# Altium schematic sheet Urukul.schdoc: 3U DDS (URUKUL) v1.1
size 420 x 297 mm; Author: G.K.; CompanyName: WUT; DrawnBy: G.K.; Organization: WUT ISE; Address1: Warsaw Univeristy of Technology; Address2: Nowowiejska 15/19; DocumentNumber: 1; Revision: -; SheetNumber: 1; SheetTotal: 7; EDA_Number: ARTIQ; Projet: ARTIQ/SINARA; ModifiedBy: -; CreateDate: XX/XX/XXXX; CheckedDate: -; Title2: Top entity; DivGrp: ISE; Designer: G.K.; ModifiedDate: -; ProjectName: ARTIQ/SINARA
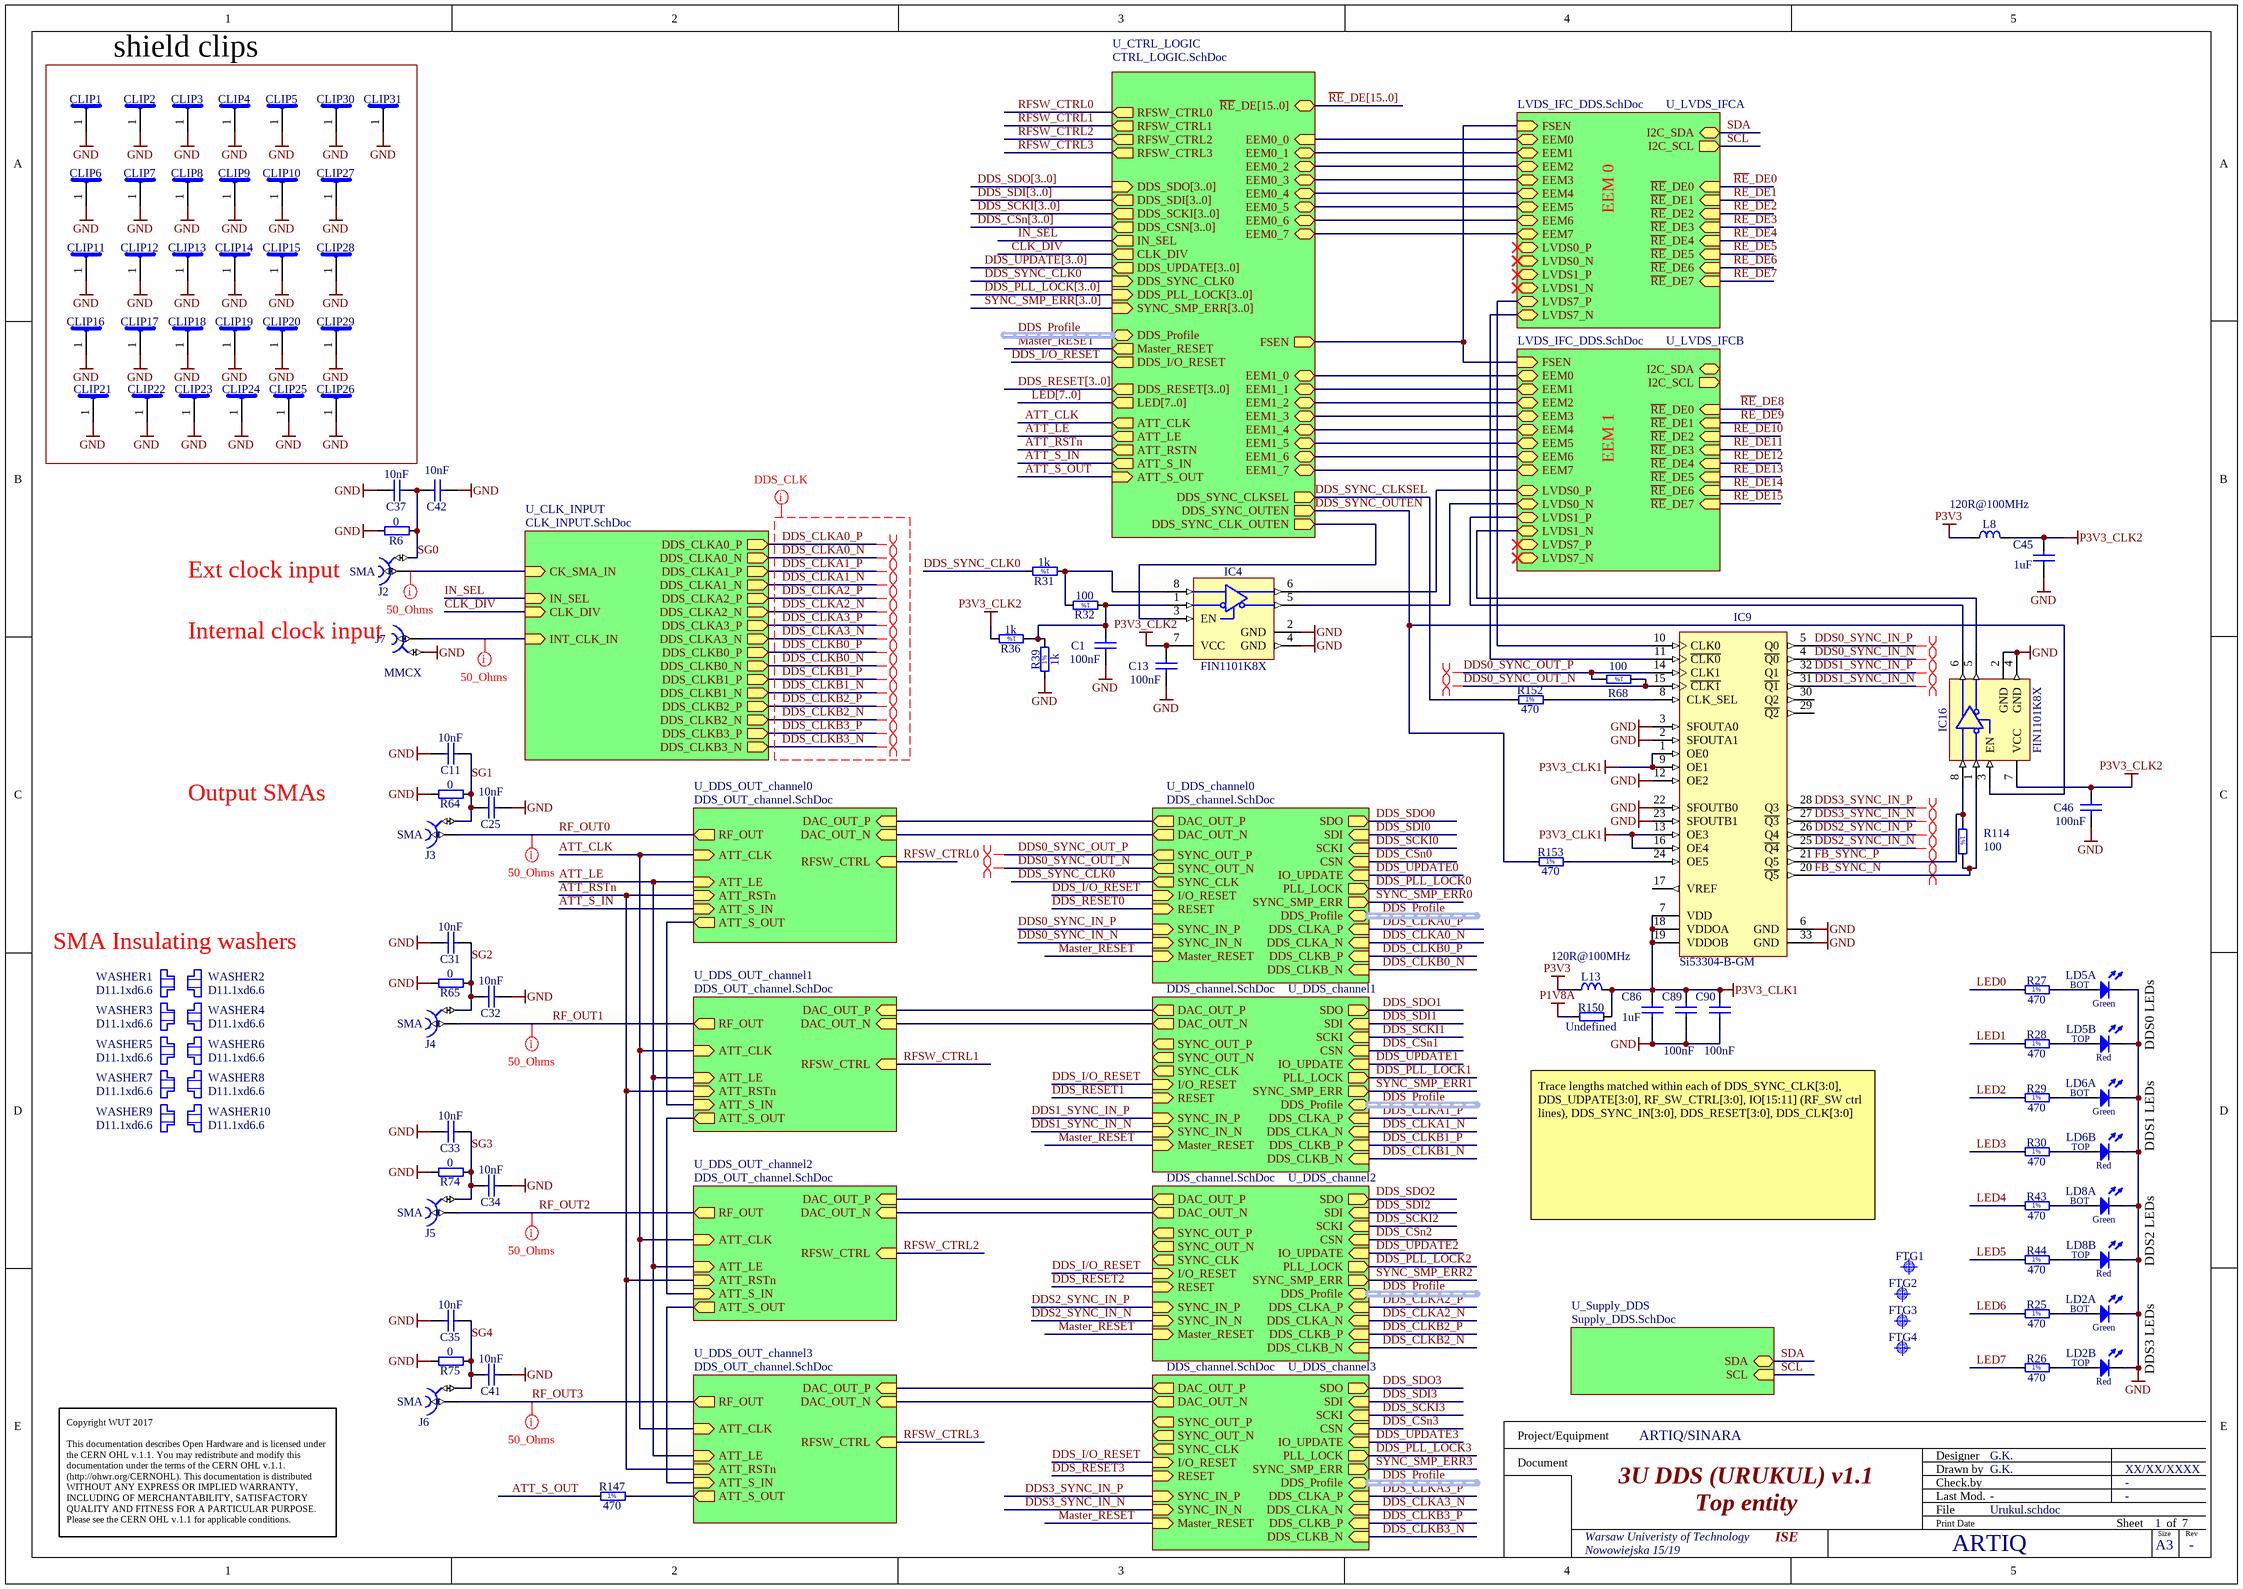
[diagram p0: Urukul.schdoc]

## Parts
C1  100nF  [CAPC1005X55N]
C11  10nF  [CAPC1005X55N]
C13  100nF  [CAPC1005X55N]
C25  10nF  [CAPC1005X55N]
C31  10nF  [CAPC1005X55N]
C32  10nF  [CAPC1005X55N]
C33  10nF  [CAPC1005X55N]
C34  10nF  [CAPC1005X55N]
C35  10nF  [CAPC1005X55N]
C37  10nF  [CAPC1005X55N]
C41  10nF  [CAPC1005X55N]
C42  10nF  [CAPC1005X55N]
C45  1uF  [CAPC1005X55N]
C46  100nF  [CAPC1005X55N]
C86  1uF  [CAPC1005X55N]
C89  100nF  [CAPC1005X55N]
C90  100nF  [CAPC1005X55N]
CLIP1  S1411-46R  [CLIP_HOLLAND-SHIELDING_LC]  (value not drawn)
CLIP2  S1411-46R  [CLIP_HOLLAND-SHIELDING_LC]  (value not drawn)
CLIP3  S1411-46R  [CLIP_HOLLAND-SHIELDING_LC]  (value not drawn)
CLIP4  S1411-46R  [CLIP_HOLLAND-SHIELDING_LC]  (value not drawn)
CLIP5  S1411-46R  [CLIP_HOLLAND-SHIELDING_LC]  (value not drawn)
CLIP6  S1411-46R  [CLIP_HOLLAND-SHIELDING_LC]  (value not drawn)
CLIP7  S1411-46R  [CLIP_HOLLAND-SHIELDING_LC]  (value not drawn)
CLIP8  S1411-46R  [CLIP_HOLLAND-SHIELDING_LC]  (value not drawn)
CLIP9  S1411-46R  [CLIP_HOLLAND-SHIELDING_LC]  (value not drawn)
CLIP10  S1411-46R  [CLIP_HOLLAND-SHIELDING_LC]  (value not drawn)
CLIP11  S1411-46R  [CLIP_HOLLAND-SHIELDING_LC]  (value not drawn)
CLIP12  S1411-46R  [CLIP_HOLLAND-SHIELDING_LC]  (value not drawn)
CLIP13  S1411-46R  [CLIP_HOLLAND-SHIELDING_LC]  (value not drawn)
CLIP14  S1411-46R  [CLIP_HOLLAND-SHIELDING_LC]  (value not drawn)
CLIP15  S1411-46R  [CLIP_HOLLAND-SHIELDING_LC]  (value not drawn)
CLIP16  S1411-46R  [CLIP_HOLLAND-SHIELDING_LC]  (value not drawn)
CLIP17  S1411-46R  [CLIP_HOLLAND-SHIELDING_LC]  (value not drawn)
CLIP18  S1411-46R  [CLIP_HOLLAND-SHIELDING_LC]  (value not drawn)
CLIP19  S1411-46R  [CLIP_HOLLAND-SHIELDING_LC]  (value not drawn)
CLIP20  S1411-46R  [CLIP_HOLLAND-SHIELDING_LC]  (value not drawn)
CLIP21  S1411-46R  [CLIP_HOLLAND-SHIELDING_LC]  (value not drawn)
CLIP22  S1411-46R  [CLIP_HOLLAND-SHIELDING_LC]  (value not drawn)
CLIP23  S1411-46R  [CLIP_HOLLAND-SHIELDING_LC]  (value not drawn)
CLIP24  S1411-46R  [CLIP_HOLLAND-SHIELDING_LC]  (value not drawn)
CLIP25  S1411-46R  [CLIP_HOLLAND-SHIELDING_LC]  (value not drawn)
CLIP26  S1411-46R  [CLIP_HOLLAND-SHIELDING_LC]  (value not drawn)
CLIP27  S1411-46R  [CLIP_HOLLAND-SHIELDING_LC]  (value not drawn)
CLIP28  S1411-46R  [CLIP_HOLLAND-SHIELDING_LC]  (value not drawn)
CLIP29  S1411-46R  [CLIP_HOLLAND-SHIELDING_LC]  (value not drawn)
CLIP30  S1411-46R  [CLIP_HOLLAND-SHIELDING_LC]  (value not drawn)
CLIP31  S1411-46R  [CLIP_HOLLAND-SHIELDING_LC]  (value not drawn)
FTG1  Use only in PCB  [FIDUCIAL_TOP_C100-200]  (value not drawn)
FTG2  Use only in PCB  [FIDUCIAL_TOP_S100-200]  (value not drawn)
FTG3  Use only in PCB  [FIDUCIAL_TOP_S200-400]  (value not drawn)
FTG4  Use only in PCB  [FIDUCIAL_TOP_S100-200]  (value not drawn)
IC4  FIN1101K8X  [SOP50P310X90-8N]
IC9  Si53304-B-GM  [SLAB-QFN-32-2150x2150TP_M]
IC16  FIN1101K8X  [SOP50P310X90-8N]
J2  SMA  [RF249BT0050GHDW]
J3  SMA  [RF249BT0050GHDW]
J4  SMA  [RF249BT0050GHDW]
J5  SMA  [RF249BT0050GHDW]
J6  SMA  [RF249BT0050GHDW]
J7  MMCX  [SAMTEC_MMCX-J-P-H-ST-TH1]
L8  120R@100MHz  [INDC1608X95N]
L13  120R@100MHz  [INDC1608X95N]
LD2  Red/Green  [LED_DIALIGHT_553-0112-200F]  (value not drawn)  (parts A,B of 2)
LD5  Red/Green  [LED_DIALIGHT_553-0112-200F]  (value not drawn)  (parts A,B of 2)
LD6  Red/Green  [LED_DIALIGHT_553-0112-200F]  (value not drawn)  (parts A,B of 2)
LD8  Red/Green  [LED_DIALIGHT_553-0112-200F]  (value not drawn)  (parts A,B of 2)
R6  0  [RESC1005X40N]
R25  470  [RESC1005X40N]
R26  470  [RESC1005X40N]
R27  470  [RESC1005X40N]
R28  470  [RESC1005X40N]
R29  470  [RESC1005X40N]
R30  470  [RESC1005X40N]
R31  1k  [RESC1005X40N]
R32  100  [RESC1005X40N]
R36  1k  [RESC1005X40N]
R39  1k  [RESC1005X40N]
R43  470  [RESC1005X40N]
R44  470  [RESC1005X40N]
R64  0  [RESC1005X40N]
R65  0  [RESC1005X40N]
R68  100  [RESC1005X40N]
R74  0  [RESC1005X40N]
R75  0  [RESC1005X40N]
R114  100  [RESC1005X40N]
R147  470  [RESC1005X40N]
R150  Undefined  [RESC1608X55N]
R152  470  [RESC1005X40N]
R153  470  [RESC1005X40N]
WASHER1  D11.1xd6.6  [Keystone_7687]
WASHER2  D11.1xd6.6  [Keystone_7687]
WASHER3  D11.1xd6.6  [Keystone_7687]
WASHER4  D11.1xd6.6  [Keystone_7687]
WASHER5  D11.1xd6.6  [Keystone_7687]
WASHER6  D11.1xd6.6  [Keystone_7687]
WASHER7  D11.1xd6.6  [Keystone_7687]
WASHER8  D11.1xd6.6  [Keystone_7687]
WASHER9  D11.1xd6.6  [Keystone_7687]
WASHER10  D11.1xd6.6  [Keystone_7687]

## Blocks framed on the sheet
shield clips: CLIP1-CLIP31

## Sub-sheets
U_CLK_INPUT = CLK_INPUT.SchDoc: CK_SMA_IN (in), INT_CLK_IN (in), IN_SEL (in), DDS_CLKA0_P (out), DDS_CLKA0_N (out), CLK_DIV (in), DDS_CLKB3_P (out), DDS_CLKB3_N (out), DDS_CLKA1_P (out), DDS_CLKA1_N (out), DDS_CLKA2_P (out), DDS_CLKA2_N (out), DDS_CLKA3_P (out), DDS_CLKA3_N (out), DDS_CLKB0_P (out), DDS_CLKB0_N (out), DDS_CLKB1_P (out), DDS_CLKB1_N (out), DDS_CLKB2_P (out), DDS_CLKB2_N (out)
U_CTRL_LOGIC = CTRL_LOGIC.SchDoc: RFSW_CTRL1 (out), RFSW_CTRL2 (out), RFSW_CTRL3 (out), RFSW_CTRL0 (out), EEM0_0 (in), EEM0_1 (bidir), IN_SEL (out), EEM0_2 (bidir), ~{RE}_DE[15..0] (bidir), DDS_UPDATE[3..0] (out), DDS_CSN[3..0] (out), DDS_SCKI[3..0] (out), DDS_SDI[3..0] (out), DDS_SDO[3..0] (in), EEM0_3 (bidir), EEM0_4 (bidir), EEM0_5 (bidir), EEM0_6 (bidir), EEM0_7 (bidir), EEM1_0 (bidir), EEM1_1 (bidir), EEM1_2 (bidir), EEM1_3 (bidir), EEM1_4 (bidir), EEM1_5 (bidir), EEM1_6 (bidir), EEM1_7 (bidir), DDS_Profile (harness DDS_Profile), ATT_CLK (out), ATT_LE (out), ATT_RSTN (out), ATT_S_IN (out), ATT_S_OUT (in), LED[7..0] (out), DDS_SYNC_CLKSEL (out), DDS_SYNC_OUTEN (out), DDS_SYNC_CLK_OUTEN (out), DDS_SYNC_CLK0 (in), DDS_I/O_RESET (out), DDS_PLL_LOCK[3..0] (in), SYNC_SMP_ERR[3..0] (in), CLK_DIV (out), Master_RESET (out), DDS_RESET[3..0] (out), FSEN (out)
U_DDS_channel0 = DDS_channel.SchDoc: CSN (in), SDI (in), SCKI (in), SDO (out), DAC_OUT_P (out), DAC_OUT_N (out), RESET (in), IO_UPDATE (in), DDS_Profile (harness DDS_Profile), SYNC_CLK (out), SYNC_OUT_P (out), SYNC_OUT_N (out), SYNC_IN_P (in), SYNC_IN_N (in), I/O_RESET (in), SYNC_SMP_ERR (out), PLL_LOCK (out), DDS_CLKB_P (in), DDS_CLKB_N (in), DDS_CLKA_P (in), DDS_CLKA_N (in), Master_RESET (in)
U_DDS_channel1 = DDS_channel.SchDoc: CSN (in), SDI (in), SCKI (in), SDO (out), DAC_OUT_P (out), DAC_OUT_N (out), IO_UPDATE (in), DDS_Profile (harness DDS_Profile), SYNC_CLK (out), SYNC_OUT_P (out), SYNC_OUT_N (out), SYNC_IN_P (in), SYNC_IN_N (in), RESET (in), I/O_RESET (in), SYNC_SMP_ERR (out), PLL_LOCK (out), DDS_CLKB_P (in), DDS_CLKB_N (in), DDS_CLKA_P (in), DDS_CLKA_N (in), Master_RESET (in)
U_DDS_channel2 = DDS_channel.SchDoc: CSN (in), SDI (in), SCKI (in), SDO (out), DAC_OUT_P (out), DAC_OUT_N (out), IO_UPDATE (in), DDS_Profile (harness DDS_Profile), SYNC_CLK (out), SYNC_OUT_P (out), SYNC_OUT_N (out), SYNC_IN_P (in), SYNC_IN_N (in), RESET (in), I/O_RESET (in), SYNC_SMP_ERR (out), PLL_LOCK (out), DDS_CLKB_P (in), DDS_CLKB_N (in), DDS_CLKA_P (in), DDS_CLKA_N (in), Master_RESET (in)
U_DDS_channel3 = DDS_channel.SchDoc: CSN (in), SDI (in), SCKI (in), SDO (out), DAC_OUT_P (out), DAC_OUT_N (out), IO_UPDATE (in), DDS_Profile (harness DDS_Profile), SYNC_CLK (out), SYNC_OUT_P (out), SYNC_OUT_N (out), SYNC_IN_P (in), SYNC_IN_N (in), RESET (in), I/O_RESET (in), SYNC_SMP_ERR (out), PLL_LOCK (out), DDS_CLKB_P (in), DDS_CLKB_N (in), DDS_CLKA_P (in), DDS_CLKA_N (in), Master_RESET (in)
U_DDS_OUT_channel0 = DDS_OUT_channel.SchDoc: DAC_OUT_P (in), DAC_OUT_N (in), RF_OUT (out), RFSW_CTRL (in), ATT_CLK (in), ATT_S_IN (in), ATT_LE (in), ATT_RSTn (in), ATT_S_OUT (out)
U_DDS_OUT_channel1 = DDS_OUT_channel.SchDoc: DAC_OUT_P (in), DAC_OUT_N (in), RF_OUT (out), RFSW_CTRL (in), ATT_CLK (in), ATT_S_IN (in), ATT_LE (in), ATT_RSTn (in), ATT_S_OUT (out)
U_DDS_OUT_channel2 = DDS_OUT_channel.SchDoc: DAC_OUT_P (in), DAC_OUT_N (in), RF_OUT (out), RFSW_CTRL (in), ATT_CLK (in), ATT_S_IN (in), ATT_LE (in), ATT_RSTn (in), ATT_S_OUT (out)
U_DDS_OUT_channel3 = DDS_OUT_channel.SchDoc: DAC_OUT_P (in), DAC_OUT_N (in), RF_OUT (out), RFSW_CTRL (in), ATT_CLK (in), ATT_S_IN (in), ATT_LE (in), ATT_RSTn (in), ATT_S_OUT (out)
U_LVDS_IFCA = LVDS_IFC_DDS.SchDoc: ~{RE}_DE1 (in), ~{RE}_DE2 (in), ~{RE}_DE3 (in), ~{RE}_DE4 (in), ~{RE}_DE5 (in), ~{RE}_DE6 (in), ~{RE}_DE7 (in), ~{RE}_DE0 (in), I2C_SDA (bidir), I2C_SCL (out), EEM1 (bidir), EEM2 (bidir), EEM5 (bidir), EEM6 (bidir), EEM7 (bidir), EEM3 (bidir), EEM4 (bidir), EEM0 (bidir), LVDS1_P (bidir), LVDS1_N (bidir), LVDS0_P (bidir), LVDS0_N (bidir), LVDS7_P (bidir), LVDS7_N (bidir), FSEN (in)
U_LVDS_IFCB = LVDS_IFC_DDS.SchDoc: I2C_SDA (bidir), I2C_SCL (out), EEM1 (bidir), EEM2 (bidir), EEM5 (bidir), EEM6 (bidir), EEM7 (bidir), EEM3 (bidir), EEM4 (bidir), EEM0 (bidir), ~{RE}_DE1 (in), ~{RE}_DE2 (in), ~{RE}_DE3 (in), ~{RE}_DE4 (in), ~{RE}_DE5 (in), ~{RE}_DE6 (in), ~{RE}_DE7 (in), ~{RE}_DE0 (in), LVDS1_P (bidir), LVDS1_N (bidir), LVDS0_P (bidir), LVDS0_N (bidir), LVDS7_P (bidir), LVDS7_N (bidir), FSEN (in)
U_Supply_DDS = Supply_DDS.SchDoc: SDA (bidir), SCL (in)

## Nets
GND: C1.1 C11.2 C13.1 C25.1 C31.2 C32.1 C33.2 C34.1 C35.2 C37.2 C41.1 C42.1 C45.1 C46.1 C86.1 C89.1 C90.1 CLIP1.1 CLIP2.1 CLIP3.1 CLIP4.1 CLIP5.1 CLIP6.1 CLIP7.1 CLIP8.1 CLIP9.1 CLIP10.1 CLIP11.1 CLIP12.1 CLIP13.1 CLIP14.1 CLIP15.1 CLIP16.1 CLIP17.1 CLIP18.1 CLIP19.1 CLIP20.1 CLIP21.1 CLIP22.1 CLIP23.1 CLIP24.1 CLIP25.1 CLIP26.1 CLIP27.1 CLIP28.1 CLIP29.1 CLIP30.1 CLIP31.1 IC4.2(GND) IC4.4(GND) IC9.2(SFOUTA1) IC9.3(SFOUTA0) IC9.6(GND) IC9.12(OE2) IC9.22(SFOUTB0) IC9.23(SFOUTB1) IC9.33(GND) IC16.2(GND) IC16.4(GND) J7.2 LD2.1(C) LD2.3(C) LD5.1(C) LD5.3(C) LD6.1(C) LD6.3(C) LD8.1(C) LD8.3(C) R6.1 R39.1 R64.1 R65.1 R74.1 R75.1
P1V8A: R150.1
P3V3: L8.2 L13.2
P3V3_CLK1: C86.2 C89.2 C90.2 IC9.1(OE0) IC9.7(VDD) IC9.9(OE1) IC9.13(OE3) IC9.16(OE4) IC9.18(VDDOA) IC9.19(VDDOB) L13.1 R150.2
P3V3_CLK2: C13.2 C45.2 C46.2 IC4.7(VCC) IC16.7(VCC) L8.1 R36.2
ATT_CLK: sheet U_DDS_OUT_channel0/ATT_CLK, sheet U_DDS_OUT_channel1/ATT_CLK, sheet U_DDS_OUT_channel2/ATT_CLK, sheet U_DDS_OUT_channel3/ATT_CLK, sheet U_CTRL_LOGIC/ATT_CLK
ATT_LE: sheet U_DDS_OUT_channel0/ATT_LE, sheet U_DDS_OUT_channel1/ATT_LE, sheet U_DDS_OUT_channel2/ATT_LE, sheet U_DDS_OUT_channel3/ATT_LE, sheet U_CTRL_LOGIC/ATT_LE
ATT_RSTn: sheet U_DDS_OUT_channel0/ATT_RSTn, sheet U_DDS_OUT_channel1/ATT_RSTn, sheet U_DDS_OUT_channel2/ATT_RSTn, sheet U_DDS_OUT_channel3/ATT_RSTn, sheet U_CTRL_LOGIC/ATT_RSTN
ATT_S_IN: sheet U_DDS_OUT_channel0/ATT_S_IN, sheet U_CTRL_LOGIC/ATT_S_IN
ATT_S_OUT: R147.1 ; sheet U_CTRL_LOGIC/ATT_S_OUT
CLK_DIV: sheet U_CTRL_LOGIC/CLK_DIV, sheet U_CLK_INPUT/CLK_DIV
DDS0_SYNC_IN_N: IC9.4(~{Q0}) ; sheet U_DDS_channel0/SYNC_IN_N
DDS0_SYNC_IN_P: IC9.5(Q0) ; sheet U_DDS_channel0/SYNC_IN_P
DDS0_SYNC_OUT_N: IC9.15(~{CLK1}) R68.1 ; sheet U_DDS_channel0/SYNC_OUT_N
DDS0_SYNC_OUT_P: IC9.14(CLK1) R68.2 ; sheet U_DDS_channel0/SYNC_OUT_P
DDS1_SYNC_IN_N: IC9.31(~{Q1}) ; sheet U_DDS_channel1/SYNC_IN_N
DDS1_SYNC_IN_P: IC9.32(Q1) ; sheet U_DDS_channel1/SYNC_IN_P
DDS2_SYNC_IN_N: IC9.25(~{Q4}) ; sheet U_DDS_channel2/SYNC_IN_N
DDS2_SYNC_IN_P: IC9.26(Q4) ; sheet U_DDS_channel2/SYNC_IN_P
DDS3_SYNC_IN_N: IC9.27(~{Q3}) ; sheet U_DDS_channel3/SYNC_IN_N
DDS3_SYNC_IN_P: IC9.28(Q3) ; sheet U_DDS_channel3/SYNC_IN_P
DDS_CLKA0_N: sheet U_DDS_channel0/DDS_CLKA_N, sheet U_CLK_INPUT/DDS_CLKA0_N
DDS_CLKA0_P: sheet U_DDS_channel0/DDS_CLKA_P, sheet U_CLK_INPUT/DDS_CLKA0_P
DDS_CLKA1_N: sheet U_DDS_channel1/DDS_CLKA_N, sheet U_CLK_INPUT/DDS_CLKA1_N
DDS_CLKA1_P: sheet U_DDS_channel1/DDS_CLKA_P, sheet U_CLK_INPUT/DDS_CLKA1_P
DDS_CLKA2_N: sheet U_DDS_channel2/DDS_CLKA_N, sheet U_CLK_INPUT/DDS_CLKA2_N
DDS_CLKA2_P: sheet U_DDS_channel2/DDS_CLKA_P, sheet U_CLK_INPUT/DDS_CLKA2_P
DDS_CLKA3_N: sheet U_DDS_channel3/DDS_CLKA_N, sheet U_CLK_INPUT/DDS_CLKA3_N
DDS_CLKA3_P: sheet U_DDS_channel3/DDS_CLKA_P, sheet U_CLK_INPUT/DDS_CLKA3_P
DDS_CLKB0_N: sheet U_DDS_channel0/DDS_CLKB_N, sheet U_CLK_INPUT/DDS_CLKB0_N
DDS_CLKB0_P: sheet U_DDS_channel0/DDS_CLKB_P, sheet U_CLK_INPUT/DDS_CLKB0_P
DDS_CLKB1_N: sheet U_DDS_channel1/DDS_CLKB_N, sheet U_CLK_INPUT/DDS_CLKB1_N
DDS_CLKB1_P: sheet U_DDS_channel1/DDS_CLKB_P, sheet U_CLK_INPUT/DDS_CLKB1_P
DDS_CLKB2_N: sheet U_DDS_channel2/DDS_CLKB_N, sheet U_CLK_INPUT/DDS_CLKB2_N
DDS_CLKB2_P: sheet U_DDS_channel2/DDS_CLKB_P, sheet U_CLK_INPUT/DDS_CLKB2_P
DDS_CLKB3_N: sheet U_DDS_channel3/DDS_CLKB_N, sheet U_CLK_INPUT/DDS_CLKB3_N
DDS_CLKB3_P: sheet U_DDS_channel3/DDS_CLKB_P, sheet U_CLK_INPUT/DDS_CLKB3_P
DDS_CSn0: sheet U_DDS_channel0/CSN
DDS_CSn1: sheet U_DDS_channel1/CSN
DDS_CSn2: sheet U_DDS_channel2/CSN
DDS_CSn3: sheet U_DDS_channel3/CSN
DDS_I/O_RESET: sheet U_DDS_channel0/I/O_RESET, sheet U_DDS_channel1/I/O_RESET, sheet U_DDS_channel2/I/O_RESET, sheet U_DDS_channel3/I/O_RESET, sheet U_CTRL_LOGIC/DDS_I/O_RESET
DDS_PLL_LOCK0: sheet U_DDS_channel0/PLL_LOCK
DDS_PLL_LOCK1: sheet U_DDS_channel1/PLL_LOCK
DDS_PLL_LOCK2: sheet U_DDS_channel2/PLL_LOCK
DDS_PLL_LOCK3: sheet U_DDS_channel3/PLL_LOCK
DDS_RESET0: sheet U_DDS_channel0/RESET
DDS_RESET1: sheet U_DDS_channel1/RESET
DDS_RESET2: sheet U_DDS_channel2/RESET
DDS_RESET3: sheet U_DDS_channel3/RESET
DDS_SCKI0: sheet U_DDS_channel0/SCKI
DDS_SCKI1: sheet U_DDS_channel1/SCKI
DDS_SCKI2: sheet U_DDS_channel2/SCKI
DDS_SCKI3: sheet U_DDS_channel3/SCKI
DDS_SDI0: sheet U_DDS_channel0/SDI
DDS_SDI1: sheet U_DDS_channel1/SDI
DDS_SDI2: sheet U_DDS_channel2/SDI
DDS_SDI3: sheet U_DDS_channel3/SDI
DDS_SDO0: sheet U_DDS_channel0/SDO
DDS_SDO1: sheet U_DDS_channel1/SDO
DDS_SDO2: sheet U_DDS_channel2/SDO
DDS_SDO3: sheet U_DDS_channel3/SDO
DDS_SYNC_CLK0: R31.2 ; sheet U_DDS_channel0/SYNC_CLK, sheet U_CTRL_LOGIC/DDS_SYNC_CLK0
DDS_SYNC_CLKSEL: R152.1 ; sheet U_CTRL_LOGIC/DDS_SYNC_CLKSEL
DDS_SYNC_OUTEN: IC16.3(EN) R153.1 ; sheet U_CTRL_LOGIC/DDS_SYNC_OUTEN
DDS_UPDATE0: sheet U_DDS_channel0/IO_UPDATE
DDS_UPDATE1: sheet U_DDS_channel1/IO_UPDATE
DDS_UPDATE2: sheet U_DDS_channel2/IO_UPDATE
DDS_UPDATE3: sheet U_DDS_channel3/IO_UPDATE
FB_SYNC_N: IC9.20(~{Q5}) IC16.1(RIN-) R114.2
FB_SYNC_P: IC9.21(Q5) IC16.8(RIN+) R114.1
IN_SEL: sheet U_CTRL_LOGIC/IN_SEL, sheet U_CLK_INPUT/IN_SEL
LED0: R27.1
LED1: R28.1
LED2: R29.1
LED3: R30.1
LED4: R43.1
LED5: R44.1
LED6: R25.1
LED7: R26.1
Master_RESET: sheet U_DDS_channel0/Master_RESET, sheet U_DDS_channel1/Master_RESET, sheet U_DDS_channel2/Master_RESET, sheet U_DDS_channel3/Master_RESET, sheet U_CTRL_LOGIC/Master_RESET
~{RE}_DE0: sheet U_LVDS_IFCA/~{RE}_DE0
~{RE}_DE1: sheet U_LVDS_IFCA/~{RE}_DE1
~{RE}_DE2: sheet U_LVDS_IFCA/~{RE}_DE2
~{RE}_DE3: sheet U_LVDS_IFCA/~{RE}_DE3
~{RE}_DE4: sheet U_LVDS_IFCA/~{RE}_DE4
~{RE}_DE5: sheet U_LVDS_IFCA/~{RE}_DE5
~{RE}_DE6: sheet U_LVDS_IFCA/~{RE}_DE6
~{RE}_DE7: sheet U_LVDS_IFCA/~{RE}_DE7
~{RE}_DE8: sheet U_LVDS_IFCB/~{RE}_DE0
~{RE}_DE9: sheet U_LVDS_IFCB/~{RE}_DE1
~{RE}_DE10: sheet U_LVDS_IFCB/~{RE}_DE2
~{RE}_DE11: sheet U_LVDS_IFCB/~{RE}_DE3
~{RE}_DE12: sheet U_LVDS_IFCB/~{RE}_DE4
~{RE}_DE13: sheet U_LVDS_IFCB/~{RE}_DE5
~{RE}_DE14: sheet U_LVDS_IFCB/~{RE}_DE6
~{RE}_DE15: sheet U_LVDS_IFCB/~{RE}_DE7
RF_OUT0: J3.1 ; sheet U_DDS_OUT_channel0/RF_OUT
RF_OUT1: J4.1 ; sheet U_DDS_OUT_channel1/RF_OUT
RF_OUT2: J5.1 ; sheet U_DDS_OUT_channel2/RF_OUT
RF_OUT3: J6.1 ; sheet U_DDS_OUT_channel3/RF_OUT
RFSW_CTRL0: sheet U_DDS_OUT_channel0/RFSW_CTRL, sheet U_CTRL_LOGIC/RFSW_CTRL0
RFSW_CTRL1: sheet U_DDS_OUT_channel1/RFSW_CTRL, sheet U_CTRL_LOGIC/RFSW_CTRL1
RFSW_CTRL2: sheet U_DDS_OUT_channel2/RFSW_CTRL, sheet U_CTRL_LOGIC/RFSW_CTRL2
RFSW_CTRL3: sheet U_DDS_OUT_channel3/RFSW_CTRL, sheet U_CTRL_LOGIC/RFSW_CTRL3
SCL: sheet U_LVDS_IFCA/I2C_SCL, sheet U_Supply_DDS/SCL
SDA: sheet U_LVDS_IFCA/I2C_SDA, sheet U_Supply_DDS/SDA
SG0: C37.1 C42.2 J2.2 R6.2
SG1: C11.1 C25.2 J3.2 R64.2
SG2: C31.1 C32.2 J4.2 R65.2
SG3: C33.1 C34.2 J5.2 R74.2
SG4: C35.1 C41.2 J6.2 R75.2
SYNC_SMP_ERR0: sheet U_DDS_channel0/SYNC_SMP_ERR
SYNC_SMP_ERR1: sheet U_DDS_channel1/SYNC_SMP_ERR
SYNC_SMP_ERR2: sheet U_DDS_channel2/SYNC_SMP_ERR
SYNC_SMP_ERR3: sheet U_DDS_channel3/SYNC_SMP_ERR
NetC1_2: C1.2 IC4.1(RIN-) R32.1 R36.1 R39.2
NetIC4_3: IC4.3(EN) ; sheet U_CTRL_LOGIC/DDS_SYNC_CLK_OUTEN
NetIC4_5: IC4.5(DOUT-) ; sheet U_LVDS_IFCB/LVDS0_N
NetIC4_6: IC4.6(DOUT+) ; sheet U_LVDS_IFCB/LVDS0_P
NetIC4_8: IC4.8(RIN+) R31.1 R32.2
NetIC9_8: IC9.8(CLK_SEL) R152.2
NetIC9_10: IC9.10(CLK0) ; sheet U_LVDS_IFCA/LVDS7_P
NetIC9_11: IC9.11(~{CLK0}) ; sheet U_LVDS_IFCA/LVDS7_N
NetIC9_24: IC9.24(OE5) R153.2
NetIC16_5: IC16.5(DOUT-) ; sheet U_LVDS_IFCB/LVDS1_N
NetIC16_6: IC16.6(DOUT+) ; sheet U_LVDS_IFCB/LVDS1_P
NetJ2_1: J2.1 ; sheet U_CLK_INPUT/CK_SMA_IN
NetJ7_1: J7.1 ; sheet U_CLK_INPUT/INT_CLK_IN
NetLD2_2: LD2.2(A) R25.2
NetLD2_4: LD2.4(A) R26.2
NetLD5_2: LD5.2(A) R27.2
NetLD5_4: LD5.4(A) R28.2
NetLD6_2: LD6.2(A) R29.2
NetLD6_4: LD6.4(A) R30.2
NetLD8_2: LD8.2(A) R43.2
NetLD8_4: LD8.4(A) R44.2
NetR147_2: R147.2 ; sheet U_DDS_OUT_channel3/ATT_S_OUT
(unnamed): sheet U_DDS_OUT_channel0/DAC_OUT_P, sheet U_DDS_channel0/DAC_OUT_P
(unnamed): sheet U_DDS_OUT_channel0/DAC_OUT_N, sheet U_DDS_channel0/DAC_OUT_N
(unnamed): sheet U_DDS_OUT_channel0/ATT_S_OUT, sheet U_DDS_OUT_channel1/ATT_S_IN
(unnamed): sheet U_DDS_OUT_channel1/DAC_OUT_P, sheet U_DDS_channel1/DAC_OUT_P
(unnamed): sheet U_DDS_OUT_channel1/DAC_OUT_N, sheet U_DDS_channel1/DAC_OUT_N
(unnamed): sheet U_DDS_OUT_channel1/ATT_S_OUT, sheet U_DDS_OUT_channel2/ATT_S_IN
(unnamed): sheet U_DDS_OUT_channel2/DAC_OUT_P, sheet U_DDS_channel2/DAC_OUT_P
(unnamed): sheet U_DDS_OUT_channel2/DAC_OUT_N, sheet U_DDS_channel2/DAC_OUT_N
(unnamed): sheet U_DDS_OUT_channel2/ATT_S_OUT, sheet U_DDS_OUT_channel3/ATT_S_IN
(unnamed): sheet U_DDS_OUT_channel3/DAC_OUT_P, sheet U_DDS_channel3/DAC_OUT_P
(unnamed): sheet U_DDS_OUT_channel3/DAC_OUT_N, sheet U_DDS_channel3/DAC_OUT_N
(unnamed): sheet U_LVDS_IFCA/EEM1, sheet U_CTRL_LOGIC/EEM0_1
(unnamed): sheet U_LVDS_IFCA/EEM2, sheet U_CTRL_LOGIC/EEM0_2
(unnamed): sheet U_LVDS_IFCA/EEM5, sheet U_CTRL_LOGIC/EEM0_5
(unnamed): sheet U_LVDS_IFCA/EEM6, sheet U_CTRL_LOGIC/EEM0_6
(unnamed): sheet U_LVDS_IFCA/EEM7, sheet U_CTRL_LOGIC/EEM0_7
(unnamed): sheet U_LVDS_IFCA/EEM3, sheet U_CTRL_LOGIC/EEM0_3
(unnamed): sheet U_LVDS_IFCA/EEM4, sheet U_CTRL_LOGIC/EEM0_4
(unnamed): sheet U_LVDS_IFCA/EEM0, sheet U_CTRL_LOGIC/EEM0_0
(unnamed): sheet U_LVDS_IFCA/FSEN, sheet U_LVDS_IFCB/FSEN, sheet U_CTRL_LOGIC/FSEN
(unnamed): sheet U_LVDS_IFCB/EEM1, sheet U_CTRL_LOGIC/EEM1_1
(unnamed): sheet U_LVDS_IFCB/EEM2, sheet U_CTRL_LOGIC/EEM1_2
(unnamed): sheet U_LVDS_IFCB/EEM5, sheet U_CTRL_LOGIC/EEM1_5
(unnamed): sheet U_LVDS_IFCB/EEM6, sheet U_CTRL_LOGIC/EEM1_6
(unnamed): sheet U_LVDS_IFCB/EEM7, sheet U_CTRL_LOGIC/EEM1_7
(unnamed): sheet U_LVDS_IFCB/EEM3, sheet U_CTRL_LOGIC/EEM1_3
(unnamed): sheet U_LVDS_IFCB/EEM4, sheet U_CTRL_LOGIC/EEM1_4
(unnamed): sheet U_LVDS_IFCB/EEM0, sheet U_CTRL_LOGIC/EEM1_0

Not connected (* = marked no-connect by the designer): IC9 17(VREF) 29(~{Q2}) 30(Q2)

## Buses and harness runs
bus DDS_CSn[3..0] = sheet U_CTRL_LOGIC/DDS_CSN[3..0]
bus DDS_PLL_LOCK[3..0] = sheet U_CTRL_LOGIC/DDS_PLL_LOCK[3..0]
bus DDS_RESET[3..0] = sheet U_CTRL_LOGIC/DDS_RESET[3..0]
bus DDS_SCKI[3..0] = sheet U_CTRL_LOGIC/DDS_SCKI[3..0]
bus DDS_SDI[3..0] = sheet U_CTRL_LOGIC/DDS_SDI[3..0]
bus DDS_SDO[3..0] = sheet U_CTRL_LOGIC/DDS_SDO[3..0]
bus DDS_UPDATE[3..0] = sheet U_CTRL_LOGIC/DDS_UPDATE[3..0]
bus LED[7..0] = sheet U_CTRL_LOGIC/LED[7..0]
bus SYNC_SMP_ERR[3..0] = sheet U_CTRL_LOGIC/SYNC_SMP_ERR[3..0]
bus ~{RE}_DE[15..0] = sheet U_CTRL_LOGIC/~{RE}_DE[15..0]
harness DDS_Profile = sheet U_CTRL_LOGIC/DDS_Profile
harness DDS_Profile = sheet U_DDS_channel0/DDS_Profile
harness DDS_Profile = sheet U_DDS_channel1/DDS_Profile
harness DDS_Profile = sheet U_DDS_channel2/DDS_Profile
harness DDS_Profile = sheet U_DDS_channel3/DDS_Profile

## Layout directives
net class 50_Ohms: NetJ2_1, NetJ7_1, RF_OUT0, RF_OUT1, RF_OUT2, RF_OUT3
differential pair: DDS0_SYNC_IN_N, DDS0_SYNC_IN_P, DDS0_SYNC_OUT_N, DDS0_SYNC_OUT_P, DDS1_SYNC_IN_N, DDS1_SYNC_IN_P, DDS2_SYNC_IN_N, DDS2_SYNC_IN_P, DDS3_SYNC_IN_N, DDS3_SYNC_IN_P, DDS_CLKA0_N, DDS_CLKA0_P, DDS_CLKA1_N, DDS_CLKA1_P, DDS_CLKA2_N, DDS_CLKA2_P, DDS_CLKA3_N, DDS_CLKA3_P, DDS_CLKB0_N, DDS_CLKB0_P, DDS_CLKB1_N, DDS_CLKB1_P, DDS_CLKB2_N, DDS_CLKB2_P, DDS_CLKB3_N, DDS_CLKB3_P, FB_SYNC_N, FB_SYNC_P
net class DDS_CLK: DDS_CLKA0_N, DDS_CLKA0_P, DDS_CLKA1_N, DDS_CLKA1_P, DDS_CLKA2_N, DDS_CLKA2_P, DDS_CLKA3_N, DDS_CLKA3_P, DDS_CLKB0_N, DDS_CLKB0_P, DDS_CLKB1_N, DDS_CLKB1_P, DDS_CLKB2_N, DDS_CLKB2_P, DDS_CLKB3_N, DDS_CLKB3_P

## Notes on the sheet
- EEM 0
- EEM 1
- (near J2) Ext clock input
- (near J7) Internal clock input
- Output SMAs
- SMA Insulating washers
- (near LD5) DDS0 LEDs
- (near LD6) DDS1 LEDs
- Trace lengths matched within each of DDS_SYNC_CLK[3:0], DDS_UDPATE[3:0], RF_SW_CTRL[3:0], IO[15:11] (RF_SW ctrl lines), DDS_SYNC_IN[3:0], DDS_RESET[3:0], DDS_CLK[3:0]
- (near LD8) DDS2 LEDs
- (near LD2) DDS3 LEDs
- Copyright WUT 2017
  This documentation describes Open Hardware and is licensed under the CERN OHL v.1.1. You may redistribute and modify this documentation under the terms of the CERN OHL v.1.1. (http://ohwr.org/CERNOHL). This documentation is distributed WITHOUT ANY EXPRESS OR IMPLIED WARRANTY, INCLUDING OF MERCHANTABILITY, SATISFACTORY QUALITY AND FITNESS FOR A PARTICULAR PURPOSE. Please see the CERN OHL v.1.1 for applicable conditions.
- Project/Equipment
- Document
- Designer
- Drawn by
- Check.by
- File
- Last Mod.
- Print Date
- Sheet
- Size
- A3
- of
- Rev
- (in symbol LED_DIALIGHT_553-0112-200F, part A) BOT; Green
- (in symbol LED_DIALIGHT_553-0112-200F, part B) TOP; Red
- (in symbol R0402_1k_1%_0.0625W_100PPM) 1%
- (in symbol R0402_1K_1%_0.0625W_100PPM) 1%
- (in symbol R0402_100R_1%_0.0625W_100PPM) 1%
- (in symbol R0402_470R_1%_0.0625W_100PPM) 1%

## Library data of the parts
C1 C13 C46 C89 C90 = CC0402_100NF_16V_10%_X5R: Non-polarised capacitor; Part Description: SMD Multilayer Chip Ceramic Capacitor; Manufacturer: GENERIC; Manufacturer1 Part Number: GRM155R61C104KA88D; Voltage: 16V; TC: X5R; Tolerance: ±10%; Part Number: CC0402_100NF_16V_10%_X5R; Component Kind: Standard; Component Type: Standard; Pin Count: 2; Value: 100nF; Status: None; Manufacturer Part Number: CC0402_100NF_16V_10%_X5R; Case: 0402; Mounted: Yes; Socket: No; SMD: Yes; Sense: No; Manufacturer1 Example: MURATA; Manufacturer1 ComponentHeight: 0.55mm; HelpURL: \\cern.ch\dfs\Applications\Altium\Datasheets\CC0402_X5R_MURATA_GRM.pdf; Author: CERN DEM JLC; CreateDate: 10.12.2013; LatestRevisionDate: 10.12.2013
C11 C25 C31-C35 C37 C41 C42 = CC0402_10NF_16V_10%_X7R: Non-polarised capacitor; Part Description: SMD Multilayer Chip Ceramic Capacitor; Manufacturer: GENERIC; Manufacturer1 Part Number: 223878715636; Voltage: 16V; TC: X7R; Tolerance: ±10%; Part Number: CC0402_10NF_16V_10%_X7R; Component Kind: Standard; Component Type: Standard; Pin Count: 2; Value: 10nF; Status: Not Recommended; Manufacturer Part Number: CC0402_10NF_16V_10%_X7R; Case: 0402; Mounted: Yes; Socket: No; SMD: Yes; Sense: No; Manufacturer1 Example: PHYCOMP; Manufacturer1 ComponentHeight: 0.55mm; HelpURL: \\cern.ch\dfs\Applications\Altium\Datasheets\CC0402_X7R_PHYCOMP.pdf; Author: CERN DEM JLC; CreateDate: 2007-12-03; LatestRevisionDate: 2007-12-03
C45 C86 = CC0402_1UF_16V_10%_X5R: Non-polarised capacitor; Part Description: SMD Multilayer Chip Ceramic Capacitor; Manufacturer: GENERIC; Manufacturer1 Part Number: C1005X5R1C105KT; Voltage: 16V; TC: X5R; Tolerance: ±10%; Part Number: CC0402_1UF_16V_10%_X5R; Component Kind: Standard; Component Type: Standard; Pin Count: 2; Value: 1uF; Status: Preferred; Manufacturer Part Number: CC0402_1UF_16V_10%_X5R; Case: 0402; Mounted: Yes; Socket: No; SMD: Yes; Sense: No; Manufacturer1 Example: TDK; Manufacturer1 ComponentHeight: 0.55mm; HelpURL: \\cern.ch\dfs\Applications\Altium\Datasheets\CC0402_X5R_TDK_C.pdf; Author: CERN DEM JLC; CreateDate: 2012-10-25; LatestRevisionDate: 2012-10-25
CLIP1-CLIP31 = SHIELD_CLIP: Surface Mount Clip for PCB Screening Covers; Part Description: Surface Mount Clip for PCB Screening Covers, 1500 Serie; Manufacturer: HARWIN; PressFit: No; Table: Metal Screening Box; Part Number: S1411-46R; Component Kind: Standard; Component Type: Standard; Pin Count: 1; PackageDescription: Surface Mount Clip for PCB Screening Covers, 1500 Serie; Mounted: Yes; Socket: No; SMD: Yes; Status: None; Manufacturer Part Number: S1411-46R; ComponentHeight: 3.5mm; HelpURL: \\cern.ch\dfs\Applications\Altium\Datasheets\CLIP_HOLLAND-SHIELDING_LC.pdf; Author: CERN DEM JLC; CreateDate: 2013-06-25; LatestRevisionDate: 2013-06-25
FTG1 = FIDUCIAL_TARGET_C100-200: Fiducial Target; Part Description: Round Fiducial Target, Top Layer, 1.0mm, Top Solder 2.0mm, Keepout =2.0mm; Mounted: No; Part Number: FIDUCIAL_TARGET_C100-200; Component Kind: Standard (No BOM); Component Type: Standard (No BOM); Pin Count: 1; Family: Fiducial; Socket: No; SMD: Yes; Sense: No; Status: None; ComponentHeight: 0mm; HelpURL: Undefined; Author: CERN DEM JLC; CreateDate: 09.02.2010; LatestRevisionDate: 04.04.2012; PackageDescription: Round Fiducial Target, Top Layer, 1.0mm, Top Solder 2.0mm, Keepout =2.0mm
FTG2 FTG4 = FIDUCIAL_TARGET_S100-200: Fiducial Target; Part Description: Square Fiducial Target, Top Layer, 1.0mm, Top Solder 2.0mm, Keepout =2.0mm; Mounted: No; Part Number: FIDUCIAL_TARGET_S100-200; Component Kind: Standard (No BOM); Component Type: Standard (No BOM); Pin Count: 1; Family: Fiducial; Socket: No; SMD: Yes; Sense: No; Status: None; ComponentHeight: 0mm; HelpURL: Undefined; Author: CERN DEM JLC; CreateDate: 09.02.2010; LatestRevisionDate: 04.04.2012; PackageDescription: Square Fiducial Target, Top Layer, 1.0mm, Top Solder 2.0mm, Keepout =2.0mm
FTG3 = FIDUCIAL_TARGET_S200-400: Fiducial Target; Part Description: Square Fiducial Target, Top Layer, 2.0mm, Top Solder 4.0mm, Keepout =4.0mm; Mounted: No; Part Number: FIDUCIAL_TARGET_S200-400; Component Kind: Standard (No BOM); Component Type: Standard (No BOM); Pin Count: 1; Family: Fiducial; Socket: No; SMD: Yes; Sense: No; Status: None; ComponentHeight: 0mm; HelpURL: Undefined; Author: CERN DEM JLC; CreateDate: 02.06.2008; LatestRevisionDate: 04.04.2012; PackageDescription: Square Fiducial Target, Top Layer, 2.0mm, Top Solder 4.0mm, Keepout =4.0mm
IC4 IC16 = FIN1101K8X: LVDS Single Port High Speed Repeater; Manufacturer: FAIRCHILD SEMICONDUCTOR; PressFit: No; Bonding: No; Part Number: FIN1101K8X; Component Kind: Standard; Component Type: Standard; Device: FIN1101K8X; PackageDescription: SOP, 0.50mm Pitch; 8 pin, 2.30mm W X 2.00mm L X 0.90mm H body, PC Medium Density; Part Description: LVDS Single Port High Speed Repeater; Manufacturer Part Number: FIN1101K8X; Pin Count: 8; Case: TSSOP8; Mounted: Yes; Socket: No; SMD: Yes; Sense: No; ComponentHeight: 0.8mm; Author: CERN DEM JLC; HelpURL: \\cern.ch\dfs\Applications\Altium\Datasheets\FIN1101K8X.pdf; CreateDate: 08.11.2016; LatestRevisionDate: 08.11.2016
IC9 = CMP-0510-00277-1: 1:6 Low Jitter Universal Buffer / Level Translator with 2:1 Input Mux and Individual OE, 1 to 725 MHz, -40 to 85 degC, 32-pin QFN; Manufacturer: Silicon Labs; Sub-Family: Clock Buffers; Output Format: LVPECL; LVDS; CML; HCSL; LVCMOS; Frequency (MHz): 1 to 725; Mounting Technology: Surface Mount; Code_JEDEC: MO-220; PartNumber: Si53304-B-GM; ComponentLink2URL: http://www.silabs.com/Support%20Documents/TechnicalDocs/Si53304.pdf; ComponentLink3URL: http://www.silabs.com/Support%20Documents/TechnicalDocs/Si53301.pdf; PackageDescription: 32-Pin Quad-Flat No-Leads Package, Body 5 x 5 mm, Pitch 0.5 mm; ComponentLink3Description: Package Specification; Code_IPC: J-STD-020; ComponentLink1Description: Manufacturer URL; ComponentLink2Description: Datasheet; ComponentLink1URL: http://www.silabs.com/; DatasheetVersion: Rev. 0.4; PackageReference: QFN-32
J2-J6 = CON_SMA_RF249BT0050GHDW: 50 Ohm Through Hole SMA Right Angle PCB Jack; Part Number: AdamTech_RF249BT0050GHDW; Manufacturer: AdamTech; PressFit: No; Component Kind: Standard; Component Type: Standard; Pin Count: 5; Family: SMA; Mounted: Yes; Socket: No; SMD: No; Sense: No; Status: None; Part Description: 50 Ohm Through Hole SMA Right Angle PCB Jack; Manufacturer Part Number: RF249BT0050GHDW; ComponentHeight: 10.44mm; HelpURL: \\cern.ch\dfs\Applications\Altium\Datasheets\AMPHENOL_132203.pdf; Author: GK; CreateDate: 06.10.2016; LatestRevisionDate: 06.10.2016
J7 = SAMTEC_MMCX-J-P-H-ST-TH1: Part Description: Straight Through-hole 50 Ohm Micro Mini RF Jack, MMCX Series; Manufacturer: SAMTEC; PressFit: No; Part Number: SAMTEC_MMCX-J-P-H-ST-TH1; Component Kind: Standard; Component Type: Standard; Pin Count: 2; Mounted: Yes; Socket: No; Sense: No; SMD: No; Status: None; Manufacturer Part Number: MMCX-J-P-H-ST-TH1; ComponentHeight: 4.35mm; HelpURL: \\cern.ch\dfs\Applications\Altium\Datasheets\SAMTEC_MMCX-J-P-H-ST-TH1.pdf; Author: CERN DEM JLC; CreateDate: 05.12.2012; LatestRevisionDate: 05.12.2012
L8 L13 = IND0603_MURATA_BLM18PG121SN1D: Inductor; Part Description: SMD EMIFIL Chip Ferrite Bead; Manufacturer: MURATA; Power: 2A; Resistance: 0.05R; Part Number: IND0603_MURATA_BLM18PG121SN1D; Component Kind: Standard; Component Type: Standard; Pin Count: 2; Value: 120R@100MHz; Status: None; Manufacturer Part Number: BLM18PG121SN1D; Case: 0603; Mounted: Yes; Socket: No; SMD: Yes; Sense: No; ComponentHeight: 0.95mm; HelpURL: \\cern.ch\dfs\Applications\Altium\Datasheets\IND0603_MURATA_BLM18P.pdf; Author: CERN DEM BC; CreateDate: 2015-07-27; LatestRevisionDate: 2015-07-27
LD2 LD5 LD6 LD8 = LED_DIALIGHT_553-0112-200F: 2x LED  Botom Green, Top Red; Part Description: Dual 3mm LEDs, Red Top, Green Bot, CBI® Circuit Board Indicator; PressFit: No; Bonding: No; Part Number: LED_DIALIGHT_553-0112-200F; Component Kind: Standard; Component Type: Standard; Color: Red/Green; PackageDescription: Dual 3mm LED  (Top: Red, Bot: Green), Body 10.55x4.32mm, Pin spacing 2.54mm; Manufacturer: DIALIGHT; Manufacturer Part Number: 553-0112-200F; Pin Count: 4; Mounted: Yes; Socket: No; SMD: No; Sense: No; ComponentHeight: 9.65mm; HelpURL: \\cern.ch\dfs\Applications\Altium\Datasheets\LED_DIALIGHT_553-0112-200F.pdf; Author: CERN DEM JMW; CreateDate: 07.06.2013; LatestRevisionDate: 07.06.2013
R6 R64 R65 R74 R75 = R0402_0R_JUMPER: Resistor; Part Description: 1A (0.05R Max DC Resistance) Zero Ohm Jumper; Manufacturer: GENERIC; Manufacturer1 Part Number: 232270591001L; PressFit: No; Part Number: R0402_0R_JUMPER; Component Kind: Standard; Component Type: Standard; Pin Count: 2; Value: 0; Status: Not Recommended; Manufacturer Part Number: R0402_0R_JUMPER; Case: 0402; Mounted: Yes; Sense: No; Socket: No; SMD: Yes; Manufacturer1 Example: YAGEO PHYCOMP; Manufacturer1 ComponentHeight: 0.4mm; HelpURL: \\cern.ch\dfs\Applications\Altium\Datasheets\R0402_Phycomp_RC0402.pdf; Author: CERN DEM JLC; CreateDate: 03.12.2007; LatestRevisionDate: 17.10.2012
R25-R30 R43 R44 R147 R152 R153 = R0402_470R_1%_0.0625W_100PPM: Resistor - 1%; Part Description: General Purpose Thick Film Chip Resistor; Manufacturer: GENERIC; Manufacturer1 Part Number: 232270674701L; TC: ±100ppm/°C; PressFit: No; Part Number: R0402_470R_1%_0.0625W_100PPM; Component Kind: Standard; Component Type: Standard; Pin Count: 2; Value: 470; Status: Not Recommended; Power: 0.0625W; Tolerance: ±1%; Manufacturer Part Number: R0402_470R_1%_0.0625W_100PPM; Case: 0402; Mounted: Yes; Sense: No; Socket: No; SMD: Yes; Manufacturer1 Example: YAGEO PHYCOMP; Manufacturer1 ComponentHeight: 0.4mm; HelpURL: \\cern.ch\dfs\Applications\Altium\Datasheets\R0402_Phycomp_RC0402.pdf; Author: CERN DEM JLC; CreateDate: 03.12.2007; LatestRevisionDate: 17.10.2012
R31 = R0402_1k_1%_0.0625W_100PPM: Resistor - 1%; Part Description: General Purpose Thick Film Chip Resistor; Manufacturer: GENERIC; Manufacturer1 Part Number: 232270671002L; TC: ±100ppm/°C; PressFit: No; Part Number: R0402_1K_1%_0.0625W_100PPM; Component Kind: Standard; Component Type: Standard; Pin Count: 2; Value: 1k; Status: Not Recommended; Power: 0.0625W; Tolerance: ±1%; Manufacturer Part Number: R0402_1K_1%_0.0625W_100PPM; Case: 0402; Mounted: Yes; Sense: No; Socket: No; SMD: Yes; Manufacturer1 Example: YAGEO PHYCOMP; Manufacturer1 ComponentHeight: 0.4mm; HelpURL: \\cern.ch\dfs\Applications\Altium\Datasheets\R0402_Phycomp_RC0402.pdf; Author: CERN DEM JLC; CreateDate: 03.12.2007; LatestRevisionDate: 17.10.2012
R32 R68 R114 = R0402_100R_1%_0.0625W_100PPM: Resistor - 1%; Part Description: General Purpose Thick Film Chip Resistor; Manufacturer: GENERIC; Manufacturer1 Part Number: 232270671001L; TC: ±100ppm/°C; PressFit: No; Part Number: R0402_100R_1%_0.0625W_100PPM; Component Kind: Standard; Component Type: Standard; Pin Count: 2; Value: 100; Status: Not Recommended; Power: 0.0625W; Tolerance: ±1%; Manufacturer Part Number: R0402_100R_1%_0.0625W_100PPM; Case: 0402; Mounted: Yes; Sense: No; Socket: No; SMD: Yes; Manufacturer1 Example: YAGEO PHYCOMP; Manufacturer1 ComponentHeight: 0.4mm; HelpURL: \\cern.ch\dfs\Applications\Altium\Datasheets\R0402_Phycomp_RC0402.pdf; Author: CERN DEM JLC; CreateDate: 03.12.2007; LatestRevisionDate: 17.10.2012
R36 R39 = R0402_1K_1%_0.0625W_100PPM: Resistor - 1%; Part Description: General Purpose Thick Film Chip Resistor; Manufacturer: GENERIC; Manufacturer1 Part Number: 232270671002L; TC: ±100ppm/°C; PressFit: No; Part Number: R0402_1K_1%_0.0625W_100PPM; Component Kind: Standard; Component Type: Standard; Pin Count: 2; Value: 1k; Status: Not Recommended; Power: 0.0625W; Tolerance: ±1%; Manufacturer Part Number: R0402_1K_1%_0.0625W_100PPM; Case: 0402; Mounted: Yes; Sense: No; Socket: No; SMD: Yes; Manufacturer1 Example: YAGEO PHYCOMP; Manufacturer1 ComponentHeight: 0.4mm; HelpURL: \\cern.ch\dfs\Applications\Altium\Datasheets\R0402_Phycomp_RC0402.pdf; Author: CERN DEM JLC; CreateDate: 03.12.2007; LatestRevisionDate: 17.10.2012
R150 = R0603_NO-VALUE: Resistor; Part Description: Reserved Footprint For a 0603 (1608) Chip Resistor; PressFit: No; Mounted: No; Part Number: R0603_NO-VALUE; Component Kind: Standard; Component Type: Standard; Pin Count: 2; Value: Undefined; Status: None; Manufacturer: Undefined; Manufacturer Part Number: R0603_NO-VALUE; Case: 0603; Sense: No; Socket: No; SMD: Yes; Manufacturer1 Example: Undefined; Manufacturer1 Part Number: Undefined; Manufacturer1 ComponentHeight: Undefined; HelpURL: Undefined; Author: CERN DEM JLC; CreateDate: 03.12.2007; LatestRevisionDate: 13.03.2008
WASHER1-WASHER10 = Keystone_7687: SMA_Shoulder Washer; Part Description: Polyphenylene Sulfide PPS Shoulder Washer; Manufacturer Part Number: 7687; PressFit: No; Part Number: Keystone 7687; Component Kind: Standard; Component Type: Mechanical; Pin Count: 0; PackageDescription: Polyphenylene Sulfide PPS Shoulder Washer; Mounted: Yes; Socket: No; SMD: No; Sense: No; Status: None; Value: D11.1xd6.6; Manufacturer: Keystone; ComponentHeight: 1.91mm; HelpURL: \\cern.ch\dfs\Applications\Altium\Datasheets\AAVID-THERMALLOY_7721-7PPSG.pdf; Author: GK; CreateDate: 28.01.2016; LatestRevisionDate: 28.01.2016